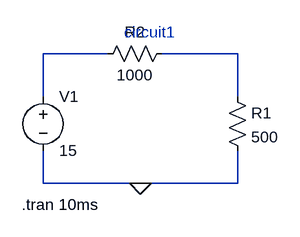
[diagram p0: schematic Draft1.asc]
Draft1.asc, the LTspice schematic file:
Version 4
SHEET 1 880 680
WIRE -304 -768 -400 -768
WIRE -112 -768 -224 -768
WIRE -400 -704 -400 -768
WIRE -112 -704 -112 -768
WIRE -400 -576 -400 -624
WIRE -256 -576 -400 -576
WIRE -112 -576 -112 -624
WIRE -112 -576 -256 -576
FLAG -256 -576 0
SYMBOL voltage -400 -720 R0
WINDOW 123 0 0 Left 0
WINDOW 39 0 0 Left 0
SYMATTR InstName V1
SYMATTR Value 15
SYMBOL res -128 -720 R0
SYMATTR InstName R1
SYMATTR Value 500
SYMBOL res -208 -784 R90
WINDOW 0 0 56 VBottom 2
WINDOW 3 32 56 VTop 2
SYMATTR InstName R2
SYMATTR Value 1000
TEXT -280 -800 Left 2 ;circuit1
TEXT -432 -544 Left 2 !.tran 10ms

The netlist it stands for:
* Draft1.asc
V1 N001 0 15
R1 N002 0 500
R2 N002 N001 1000
* circuit1
.tran 10ms
.backanno
.end